# EAGLE design mcp23016-8buton8led_hw2.0 (EAGLE 6.5.0)
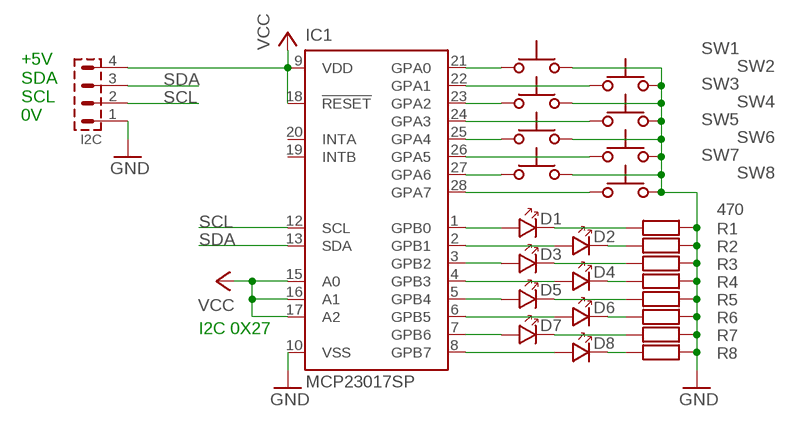
[diagram p0: schematic, sheet 1]

## Parts
D1  LED_5  [LED_5]
D2  LED_5  [LED_5]
D3  LED_5  [LED_5]
D4  LED_5  [LED_5]
D5  LED_5  [LED_5]
D6  LED_5  [LED_5]
D7  LED_5  [LED_5]
D8  LED_5  [LED_5]
I2C  S1G4_JUMP  [S1G4_JUM]
IC1  MCP23017SP  [DIL28-3]
R1  470  R_5  [R-5]
R2  R_5  [R-5]
R3  R_5  [R-5]
R4  R_5  [R-5]
R5  R_5  [R-5]
R6  R_5  [R-5]
R7  R_5  [R-5]
R8  R_5  [R-5]
SW1  P-B1720  [P-B1720]
SW2  P-B1720  [P-B1720]
SW3  P-B1720  [P-B1720]
SW4  P-B1720  [P-B1720]
SW5  P-B1720  [P-B1720]
SW6  P-B1720  [P-B1720]
SW7  P-B1720  [P-B1720]
SW8  P-B1720  [P-B1720]

## Nets
GND: I2C.1 IC1.10(VSS) R1.2 R2.2 R3.2 R4.2 R5.2 R6.2 R7.2 R8.2 SW1.2 SW2.2 SW3.2 SW4.2 SW5.2 SW6.2 SW7.2 SW8.2
N$1: D1.A IC1.1(GPB0)
N$2: D2.A IC1.2(GPB1)
N$3: D3.A IC1.3(GPB2)
N$4: D4.A IC1.4(GPB3)
N$5: D5.A IC1.5(GPB4)
N$6: D6.A IC1.6(GPB5)
N$7: D7.A IC1.7(GPB6)
N$8: D8.A IC1.8(GPB7)
N$9: D1.K R1.1
N$10: D2.K R2.1
N$11: D3.K R3.1
N$12: D4.K R4.1
N$13: D5.K R5.1
N$14: D6.K R6.1
N$15: D7.K R7.1
N$16: D8.K R8.1
N$17: IC1.21(GPA0) SW1.1
N$18: IC1.22(GPA1) SW2.1
N$19: IC1.23(GPA2) SW3.1
N$20: IC1.24(GPA3) SW4.1
N$21: IC1.25(GPA4) SW5.1
N$22: IC1.26(GPA5) SW6.1
N$23: IC1.27(GPA6) SW7.1
N$24: IC1.28(GPA7) SW8.1
SCL: I2C.2 IC1.12(SCL)
SDA: I2C.3 IC1.13(SDA)
VCC: I2C.4 IC1.9(VDD) IC1.15(A0) IC1.16(A1) IC1.17(A2) IC1.18(!RESET)
Unconnected: IC1.19(INTB) IC1.20(INTA) SW1.3(1A) SW1.4(2A) SW2.3(1A) SW2.4(2A) SW3.3(1A) SW3.4(2A) SW4.3(1A) SW4.4(2A) SW5.3(1A) SW5.4(2A) SW6.3(1A) SW6.4(2A) SW7.3(1A) SW7.4(2A) SW8.3(1A) SW8.4(2A)

## Notes on the sheet
- +5V
  SDA
  SCL
  0V
- I2C 0X27

## Library data of the parts
D1-D8 = #PaJa_31:LED: LED - jednobarevna
I2C = #PaJa_konektory:S1G4_JUMP: Radove konektory - koliky - 4x
IC1 = microchip:MCP23017: http://ww1.microchip.com/downloads/en/DeviceDoc/21952a.pdf Source: http://ww1.microchip.com/downloads/en/DeviceDoc/21952a.pdf; MF: MICROCHIP; MPN: MCP23017-E/SP; OC_FARNELL: 1332088; OC_NEWARK: 31K2959
R1-R8 = #PaJa_31:R: Rezistor
SW1-SW8 = #PaJa_prepinace:P-B1720: µ-tlacitko

## Board
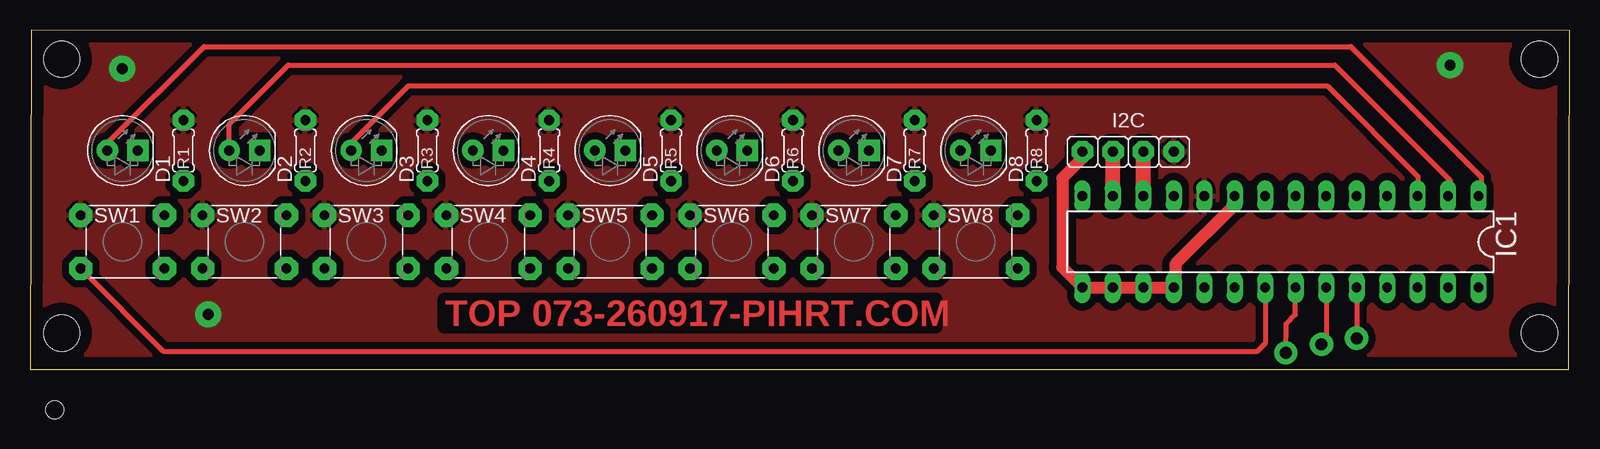
[diagram p1: board, top side]
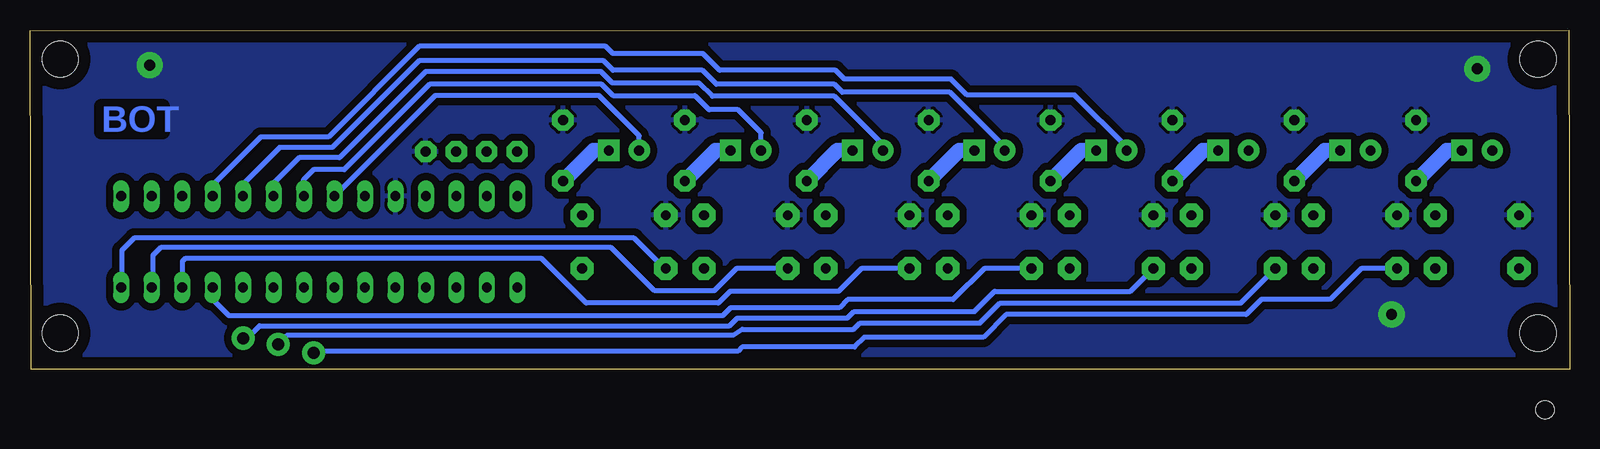
[diagram p2: board, bottom side, seen from below]

Size 128.35 x 28.32 mm. Coordinates in mm from the lower left corner, seen from the top.
Outline: 0,0 128.25,0 128.35,28.25 0.1,28.32 0,0
Copper layers (1*16): Top 0.035mm / dielectric 1.5mm / Bottom 0.035mm
Design rules "default": minimum track width 10mil, minimum drill 24mil, track to track 8mil, track to pad 8mil, pad to pad 8mil, via to via 8mil, smd to smd 8mil, copper to edge 40mil, drill to drill 8mil, minimum pad ring 10mil, minimum via ring 8mil, stop-mask expansion 4mil, vias tented up to drill 0mil, thermal gap 10mil
Holes 3 mm at 2.64,25.88 2.64,3.02 125.83,25.88 125.83,3.02
Holes 1.5 mm at 1.96,32.16 126.57,32.29 132.96,0.7 2.05,-3.38

### Footprints (pad centres in the part's own frame; a part is rotated, then mirrored left to right if it is on the bottom)
LED_5 = drill 0.813 pad 1.778: A -1.27,0 | drill 0.813 pad 1.778 square: K 1.27,0
S1G4_JUM = drill 0.813 pad 1.778 octagon: 1 -3.81,0; 2 -1.27,0; 3 1.27,0; 4 3.81,0
DIL28-3 = drill 0.813 long: 1 -16.51,-3.81; 2 -13.97,-3.81; 3 -11.43,-3.81; 4 -8.89,-3.81; 5 -6.35,-3.81; 6 -3.81,-3.81; 7 -1.27,-3.81; 8 1.27,-3.81; 9 3.81,-3.81; 10 6.35,-3.81; 11 8.89,-3.81; 12 11.43,-3.81; 13 13.97,-3.81; 14 16.51,-3.81; 15 16.51,3.81; 16 13.97,3.81; 17 11.43,3.81; 18 8.89,3.81; 19 6.35,3.81; 20 3.81,3.81; 21 1.27,3.81; 22 -1.27,3.81; 23 -3.81,3.81; 24 -6.35,3.81; 25 -8.89,3.81; 26 -11.43,3.81; 27 -13.97,3.81; 28 -16.51,3.81
R-5 = drill 0.813 pad 1.778 octagon: 1 -2.54,0; 2 2.54,0
P-B1720 = drill 0.813 pad 1.93 octagon: 1 -3.493,-2.223; 2 -3.493,2.223; 3 3.493,-2.223; 4 3.493,2.223

### Placement (x,y rotation side)
D1  7.72,18.26 0 top
D2  17.88,18.26 0 top
D3  28.04,18.26 0 top
D4  38.2,18.26 0 top
D5  48.36,18.26 0 top
D6  58.52,18.26 0 top
D7  68.68,18.26 0 top
D8  78.84,18.26 0 top
I2C  91.55,18.17 180 top
IC1  104.24,10.64 180 top
R1  12.8,18.26 90 top
R2  22.96,18.26 90 top
R3  33.12,18.26 90 top
R4  43.28,18.26 90 top
R5  53.44,18.26 90 top
R6  63.6,18.26 90 top
R7  73.76,18.26 90 top
R8  83.92,18.26 90 top
SW1  7.72,10.64 0 top
SW2  17.88,10.64 0 top
SW3  28.04,10.64 0 top
SW4  38.2,10.64 0 top
SW5  48.36,10.64 0 top
SW6  58.52,10.64 0 top
SW7  68.68,10.64 0 top
SW8  78.84,10.64 0 top

### Tracks (layer width: path | path; a pad name or v marks a point on that pad's centre or on a via)
GND  (via drill 0.9 pad 2.18)
  other vias: 118.37,25.38 7.69,25.09 14.84,4.58
  pour Top (isolate 0.61): -0.6,29.28 129.27,29.28 129.27,-0.77 -0.58,-0.77 -0.58,29.27
  pour Bottom (isolate 0.61): -1.18,29.96 129.63,29.96 129.63,-0.77 -1.1,-0.77 -1.1,29.9
N$1
  Top 0.406: D1.A 6.45,18.86 14.51,26.92 110.12,26.92 120.99,16.06 120.99,14.69 IC1.1
N$2
  Top 0.406: D2.A 16.61,20.46 21.53,25.38 108.78,25.38 118.39,15.77 118.39,14.64 IC1.2
N$3
  Top 0.406: D3.A 26.77,18.88 31.56,23.67 108.13,23.67 115.7,16.1 115.7,14.49 IC1.3
N$4
  Bottom 0.406: D4.A 36.93,18.54 41.28,22.9 50.23,22.9 51.57,24.23 60.46,24.23 61.18,24.95 70.85,24.95 72.24,26.35 79.75,26.35 80.36,26.96 95.9,26.96 103.46,19.39 109.11,19.39 113.28,15.22 113.28,14.61 IC1.4
N$5
  Bottom 0.406: D5.A 47.09,18.53 51.68,23.12 60.63,23.12 61.29,23.79 71.13,23.79 72.3,24.96 79.75,24.96 80.53,25.73 95.92,25.73 103.15,18.5 107.54,18.5 110.65,15.39 110.65,14.52 IC1.5
N$6
  Bottom 0.406: D6.A 57.25,18.74 61.29,22.79 71.46,22.79 72.58,23.9 79.8,23.9 80.75,24.84 95.36,24.84 102.54,17.67 105.92,17.67 108.21,15.39 108.21,14.61 IC1.6
N$7
  Bottom 0.406: D7.A 67.4,19.74 69.32,21.67 71.73,21.67 72.91,22.85 79.75,22.85 80.69,23.79 95.03,23.79 102.15,16.67 104.7,16.67 105.54,15.83 105.54,14.48 IC1.7
N$8
  Bottom 0.406: D8.A 77.57,19.49 80.91,22.84 94.58,22.84 IC1.8
N$9
  Bottom 1.27: D1.K 10.26,18.26 R1.1
N$10
  Bottom 1.27: D2.K 20.42,18.26 R2.1
N$11
  Bottom 1.27: D3.K 30.58,18.26 R3.1
N$12
  Bottom 1.27: D4.K 40.74,18.26 R4.1
N$13
  Bottom 1.27: D5.K 50.9,18.26 R5.1
N$14
  Bottom 1.27: D6.K 61.06,18.26 R6.1
N$15
  Bottom 1.27: D7.K 71.22,18.26 R7.1
N$16
  Bottom 1.27: D8.K 81.38,18.26 R8.1
N$17
  Top 0.406: IC1.21 102.97,2.19 102.26,1.48 11.16,1.48 SW1.1
N$18  (via drill 1 pad 1.93)
  Top 0.406: v104.7,1.38 104.72,3.8 105.49,4.57 105.49,6.81 IC1.22
  Bottom 0.406: SW2.1 17.38,8.42 19.95,5.85 25.68,5.85 26.96,4.57 46.98,4.57 48.88,2.68 58.79,2.68 59.6,1.87 68.98,1.87 69.33,1.52 104.68,1.52 v104.7,1.38
N$19  (via drill 1 pad 1.93)
  Top 0.406: IC1.23 108.05,2.47 v107.66,2.09
  Bottom 0.406: v107.66,2.09 107.4,2.09 106.89,2.86 69.72,2.86 68.98,3.34 59.68,3.34 59.14,3.88 49.15,3.88 47.49,5.54 27.42,5.54 SW3.1
N$20  (via drill 1 pad 1.93)
  Top 0.406: IC1.24 v110.59,2.61 v110.58,2.6
  Bottom 0.406: v110.58,2.6 110.23,2.6 109.2,3.63 70.02,3.63 69.38,4.28 60.21,4.28 59.65,4.84 49.6,4.84 47.94,6.5 36.62,6.5 SW4.1
N$21
  Bottom 0.406: SW5.1 48.8,8.42 51.4,5.82 60.2,5.82 60.87,5.14 69.94,5.14 70.62,4.47 111.75,4.47 113.21,5.92 113.21,6.75 IC1.25
N$22
  Bottom 0.406: SW6.1 59.04,8.42 60.95,6.5 69.98,6.5 70.95,5.53 81.97,5.53 85.68,9.24 115.41,9.24 115.64,9.01 115.64,6.85 IC1.26
N$23
  Bottom 0.406: SW7.1 69.46,8.42 71.32,6.55 76.28,6.55 79.89,10.17 117.45,10.17 118.1,9.52 118.1,6.94 IC1.27
N$24
  Bottom 0.406: SW8.1 75.46,8.42 77.99,10.95 119.67,10.95 120.69,9.93 120.69,6.89 IC1.28
SCL
  Top 1.27: IC1.12 92.81,18.15 I2C.2
SDA
  Top 1.27: IC1.13 90.27,18.15 I2C.3
VCC
  Top 1.016: I2C.4 87.74,17.65 86.05,15.96 86.05,8.51 IC1.15 IC1.16 IC1.17 IC1.18 95.5,6.98 95.5,8.78 100.43,13.7 IC1.9
(copper drawn outside any net)
  shapes: Bottom circle x4

### Text on the board
Top: TOP 073-260917-PIHRT.COM
Bottom: BOT